# Altium schematic sheet SigCapture2.SchDoc
size A
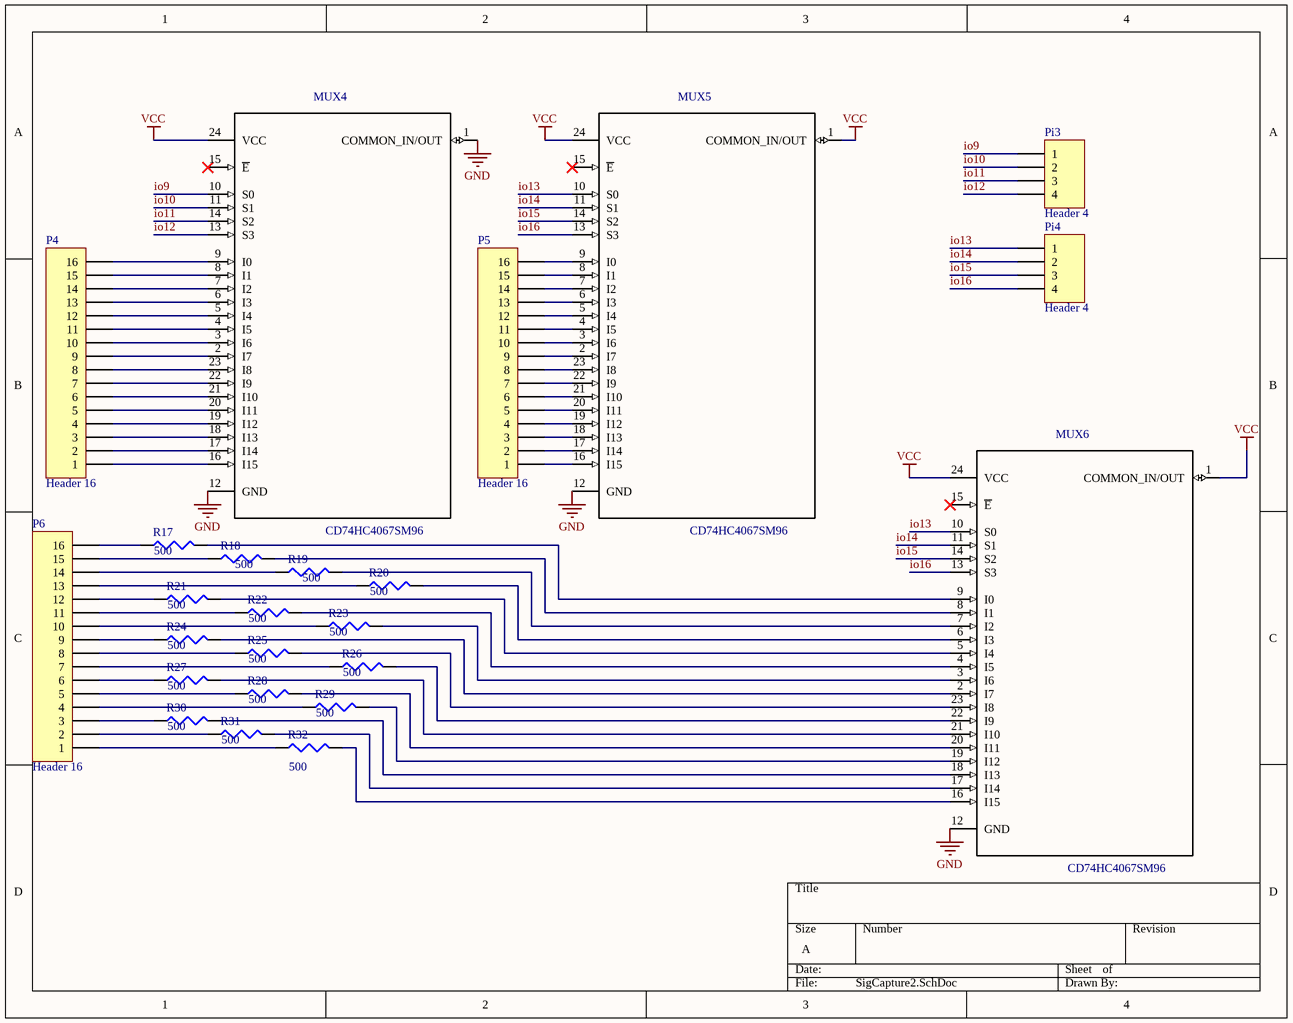
[diagram p0: SigCapture2.SchDoc]

## Parts
MUX4  CD74HC4067SM96  [SOP65P780X200-24N]
MUX5  CD74HC4067SM96  [SOP65P780X200-24N]
MUX6  CD74HC4067SM96  [SOP65P780X200-24N]
P4  Header 16  [HDR1X16]
P5  Header 16  [HDR1X16]
P6  Header 16  [HDR1X16]
Pi3  Header 4  [HDR1X4]
Pi4  Header 4  [HDR1X4]
R17  value 500  [J1-0603]  (hidden comment: Res3)
R18  value 500  [J1-0603]  (hidden comment: Res3)
R19  value 500  [J1-0603]  (hidden comment: Res3)
R20  value 500  [J1-0603]  (hidden comment: Res3)
R21  value 500  [J1-0603]  (hidden comment: Res3)
R22  value 500  [J1-0603]  (hidden comment: Res3)
R23  value 500  [J1-0603]  (hidden comment: Res3)
R24  value 500  [J1-0603]  (hidden comment: Res3)
R25  value 500  [J1-0603]  (hidden comment: Res3)
R26  value 500  [J1-0603]  (hidden comment: Res3)
R27  value 500  [J1-0603]  (hidden comment: Res3)
R28  value 500  [J1-0603]  (hidden comment: Res3)
R29  value 500  [J1-0603]  (hidden comment: Res3)
R30  value 500  [J1-0603]  (hidden comment: Res3)
R31  value 500  [J1-0603]  (hidden comment: Res3)
R32  value 500  [J1-0603]  (hidden comment: Res3)

## Nets
GND: MUX4.1(COMMON_IN/OUT) MUX4.12(GND) MUX5.12(GND) MUX6.12(GND)
VCC: MUX4.24(VCC) MUX5.1(COMMON_IN/OUT) MUX5.24(VCC) MUX6.1(COMMON_IN/OUT) MUX6.24(VCC)
io9: MUX4.10(S0) Pi3.1
io10: MUX4.11(S1) Pi3.2
io11: MUX4.14(S2) Pi3.3
io12: MUX4.13(S3) Pi3.4
io13: MUX5.10(S0) MUX6.10(S0) Pi4.1
io14: MUX5.11(S1) MUX6.11(S1) Pi4.2
io15: MUX5.14(S2) MUX6.14(S2) Pi4.3
io16: MUX5.13(S3) MUX6.13(S3) Pi4.4
NetMUX4_2: MUX4.2(I7) P4.9
NetMUX4_3: MUX4.3(I6) P4.10
NetMUX4_4: MUX4.4(I5) P4.11
NetMUX4_5: MUX4.5(I4) P4.12
NetMUX4_6: MUX4.6(I3) P4.13
NetMUX4_7: MUX4.7(I2) P4.14
NetMUX4_8: MUX4.8(I1) P4.15
NetMUX4_9: MUX4.9(I0) P4.16
NetMUX4_16: MUX4.16(I15) P4.1
NetMUX4_17: MUX4.17(I14) P4.2
NetMUX4_18: MUX4.18(I13) P4.3
NetMUX4_19: MUX4.19(I12) P4.4
NetMUX4_20: MUX4.20(I11) P4.5
NetMUX4_21: MUX4.21(I10) P4.6
NetMUX4_22: MUX4.22(I9) P4.7
NetMUX4_23: MUX4.23(I8) P4.8
NetMUX5_2: MUX5.2(I7) P5.9
NetMUX5_3: MUX5.3(I6) P5.10
NetMUX5_4: MUX5.4(I5) P5.11
NetMUX5_5: MUX5.5(I4) P5.12
NetMUX5_6: MUX5.6(I3) P5.13
NetMUX5_7: MUX5.7(I2) P5.14
NetMUX5_8: MUX5.8(I1) P5.15
NetMUX5_9: MUX5.9(I0) P5.16
NetMUX5_16: MUX5.16(I15) P5.1
NetMUX5_17: MUX5.17(I14) P5.2
NetMUX5_18: MUX5.18(I13) P5.3
NetMUX5_19: MUX5.19(I12) P5.4
NetMUX5_20: MUX5.20(I11) P5.5
NetMUX5_21: MUX5.21(I10) P5.6
NetMUX5_22: MUX5.22(I9) P5.7
NetMUX5_23: MUX5.23(I8) P5.8
NetMUX6_2: MUX6.2(I7) R24.2
NetMUX6_3: MUX6.3(I6) R23.2
NetMUX6_4: MUX6.4(I5) R22.2
NetMUX6_5: MUX6.5(I4) R21.2
NetMUX6_6: MUX6.6(I3) R20.2
NetMUX6_7: MUX6.7(I2) R19.2
NetMUX6_8: MUX6.8(I1) R18.2
NetMUX6_9: MUX6.9(I0) R17.2
NetMUX6_16: MUX6.16(I15) R32.2
NetMUX6_17: MUX6.17(I14) R31.2
NetMUX6_18: MUX6.18(I13) R30.2
NetMUX6_19: MUX6.19(I12) R29.2
NetMUX6_20: MUX6.20(I11) R28.2
NetMUX6_21: MUX6.21(I10) R27.2
NetMUX6_22: MUX6.22(I9) R26.2
NetMUX6_23: MUX6.23(I8) R25.2
NetP6_1: P6.1 R32.1
NetP6_2: P6.2 R31.1
NetP6_3: P6.3 R30.1
NetP6_4: P6.4 R29.1
NetP6_5: P6.5 R28.1
NetP6_6: P6.6 R27.1
NetP6_7: P6.7 R26.1
NetP6_8: P6.8 R25.1
NetP6_9: P6.9 R24.1
NetP6_10: P6.10 R23.1
NetP6_11: P6.11 R22.1
NetP6_12: P6.12 R21.1
NetP6_13: P6.13 R20.1
NetP6_14: P6.14 R19.1
NetP6_15: P6.15 R18.1
NetP6_16: P6.16 R17.1

Not connected (* = marked no-connect by the designer): MUX4 15(~{E})*; MUX5 15(~{E})*; MUX6 15(~{E})*

## Library data of the parts
MUX4-MUX6 = CD74HC4067SM96: High Speed CMOS 16-Channel Analog Multiplexer/Demultiplexer 24-SSOP -55 to 125; MF: Texas Instruments; MP: CD74HC4067SM96; Price: None; Availability: Unavailable; Package: SSOP-24 Texas Instruments; SnapEDA_Link: https://www.snapeda.com/parts/CD74HC4067SM96/Texas%20Instruments/view-part/?ref=snap; Value: *
P4-P6 = Header 16: Header, 16-Pin; LatestRevisionDate: 17-Jul-2002; LatestRevisionNote: Re-released for DXP Platform.; Publisher: Altium Limited
Pi3 Pi4 = Header 4: Header, 4-Pin; LatestRevisionDate: 17-Jul-2002; LatestRevisionNote: Re-released for DXP Platform.; Publisher: Altium Limited
R17-R32 = Res3: Resistor; Published: 8-Jun-2000; LatestRevisionDate: 29-May-2009; LatestRevisionNote: IPC-7351 Footprint Added.; PackageReference: J1-0603; Publisher: Altium Limited; PackageDescription: Chip Resistor